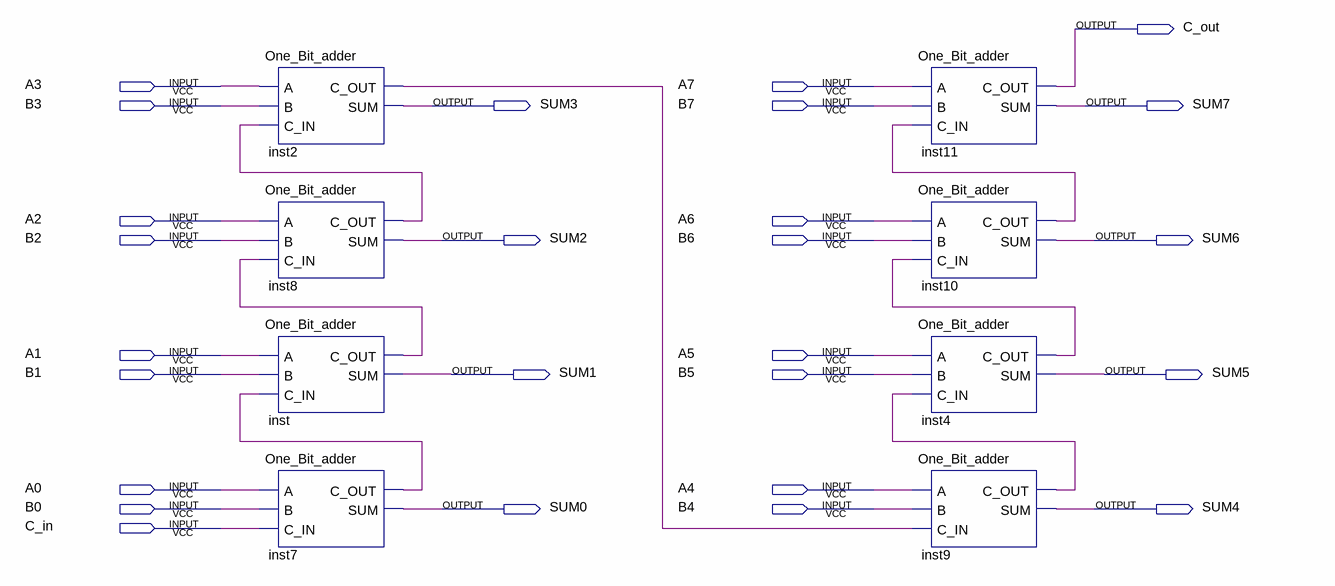
[diagram p0: schematic sheet]
// Quartus schematic Parallel_Adder.bdf as structural Verilog: 8 symbols, 26 pins
module Parallel_Adder (
  input  A3,
  input  A7,
  input  B3,
  input  B7,
  input  A2,
  input  A6,
  input  B2,
  input  B6,
  input  A1,
  input  A5,
  input  B1,
  input  B5,
  input  A0,
  input  A4,
  input  B0,
  input  B4,
  input  C_in,
  output C_out,
  output SUM3,
  output SUM7,
  output SUM2,
  output SUM6,
  output SUM1,
  output SUM5,
  output SUM0,
  output SUM4
);

  wire inst2_c_out, inst4_c_out, inst7_c_out, inst8_c_out, inst9_c_out, inst10_c_out, inst_c_out;

  One_Bit_adder inst2 (.A(A3), .B(B3), .C_IN(inst8_c_out), .C_OUT(inst2_c_out), .SUM(SUM3));
  One_Bit_adder inst8 (.A(A2), .B(B2), .C_IN(inst_c_out), .C_OUT(inst8_c_out), .SUM(SUM2));
  One_Bit_adder inst (.A(A1), .B(B1), .C_IN(inst7_c_out), .C_OUT(inst_c_out), .SUM(SUM1));
  One_Bit_adder inst7 (.A(A0), .B(B0), .C_IN(C_in), .C_OUT(inst7_c_out), .SUM(SUM0));
  One_Bit_adder inst11 (.A(A7), .B(B7), .C_IN(inst10_c_out), .C_OUT(C_out), .SUM(SUM7));
  One_Bit_adder inst10 (.A(A6), .B(B6), .C_IN(inst4_c_out), .C_OUT(inst10_c_out), .SUM(SUM6));
  One_Bit_adder inst4 (.A(A5), .B(B5), .C_IN(inst9_c_out), .C_OUT(inst4_c_out), .SUM(SUM5));
  One_Bit_adder inst9 (.A(A4), .B(B4), .C_IN(inst2_c_out), .C_OUT(inst9_c_out), .SUM(SUM4));
endmodule
